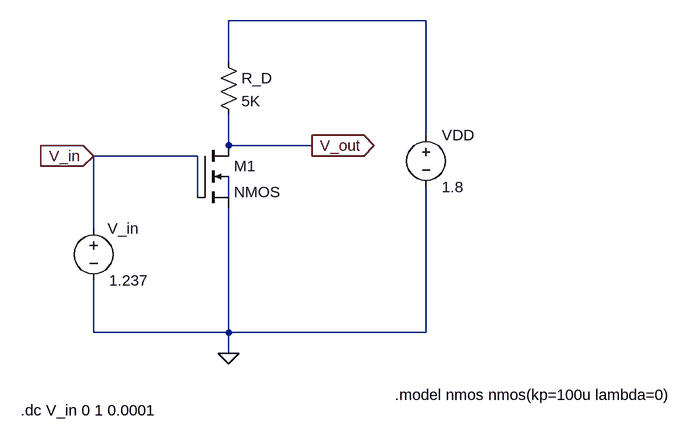
[diagram p0: schematic 3.asc]
3.asc, the LTspice schematic file:
Version 4
SHEET 1 988 680
WIRE 464 -128 160 -128
WIRE 160 -64 160 -128
WIRE 464 48 464 -128
WIRE 160 64 160 16
WIRE 288 64 160 64
WIRE 112 80 -48 80
WIRE 112 144 112 80
WIRE 160 144 160 112
WIRE -48 192 -48 80
WIRE -48 352 -48 272
WIRE 160 352 160 160
WIRE 160 352 -48 352
WIRE 464 352 464 128
WIRE 464 352 160 352
WIRE 160 384 160 352
FLAG 160 384 0
FLAG -48 80 V_in
IOPIN -48 80 In
FLAG 288 64 V_out
IOPIN 288 64 Out
SYMBOL res 144 -80 R0
SYMATTR InstName R_D
SYMATTR Value 5K
SYMBOL voltage -48 176 R0
WINDOW 0 46 16 Center 2
WINDOW 123 0 0 Left 0
WINDOW 39 0 0 Left 0
SYMATTR InstName V_in
SYMATTR Value 1.237
SYMBOL voltage 464 32 R0
WINDOW 123 0 0 Left 0
WINDOW 39 0 0 Left 0
SYMATTR InstName VDD
SYMATTR Value 1.8
SYMBOL nmos4 112 64 R0
SYMATTR InstName M1
SYMATTR Value2 l=0.18 w=20
TEXT 416 448 Left 2 !.model nmos nmos(kp=100u lambda=0)
TEXT -160 472 Left 2 !.dc V_in 0 1 0.0001

The netlist it stands for:
* 3.asc
R_D N001 V_out 5K
V_in V_in 0 1.237
VDD N001 0 1.8
M1 V_out V_in 0 N002 NMOS l=0.18 w=20
.model NMOS NMOS
.model PMOS PMOS
.lib standard.mos
.model nmos nmos(kp=100u lambda=0)
.dc V_in 0 1 0.0001
.backanno
.end

* Results of the author's LTspice run, read from the files saved beside the schematic
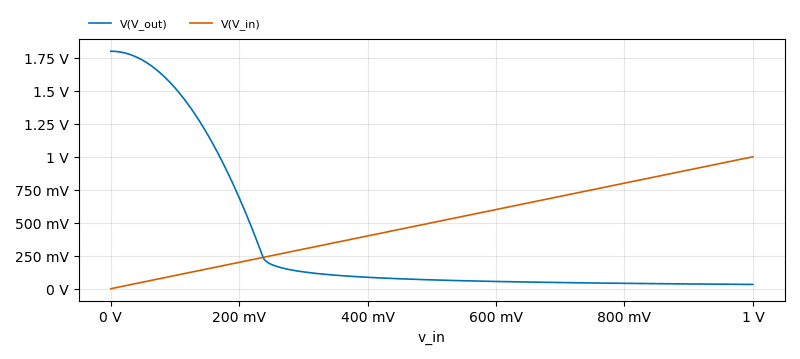
[diagram p1: DC transfer characteristic of 3.asc, plotted from the saved traces]
* DC transfer characteristic, 1 run:
*   V(V_out): 1.8 V at v_in=0 V, 32.34 mV at v_in=1 V, min 32.34 mV, max 1.8 V
*   V(V_in): 0 V at v_in=0 V, 1 V at v_in=1 V, min 0 V, max 1 V